# EAGLE design Resolver to digital concerter AD2S1210 (EAGLE 8.6.0)
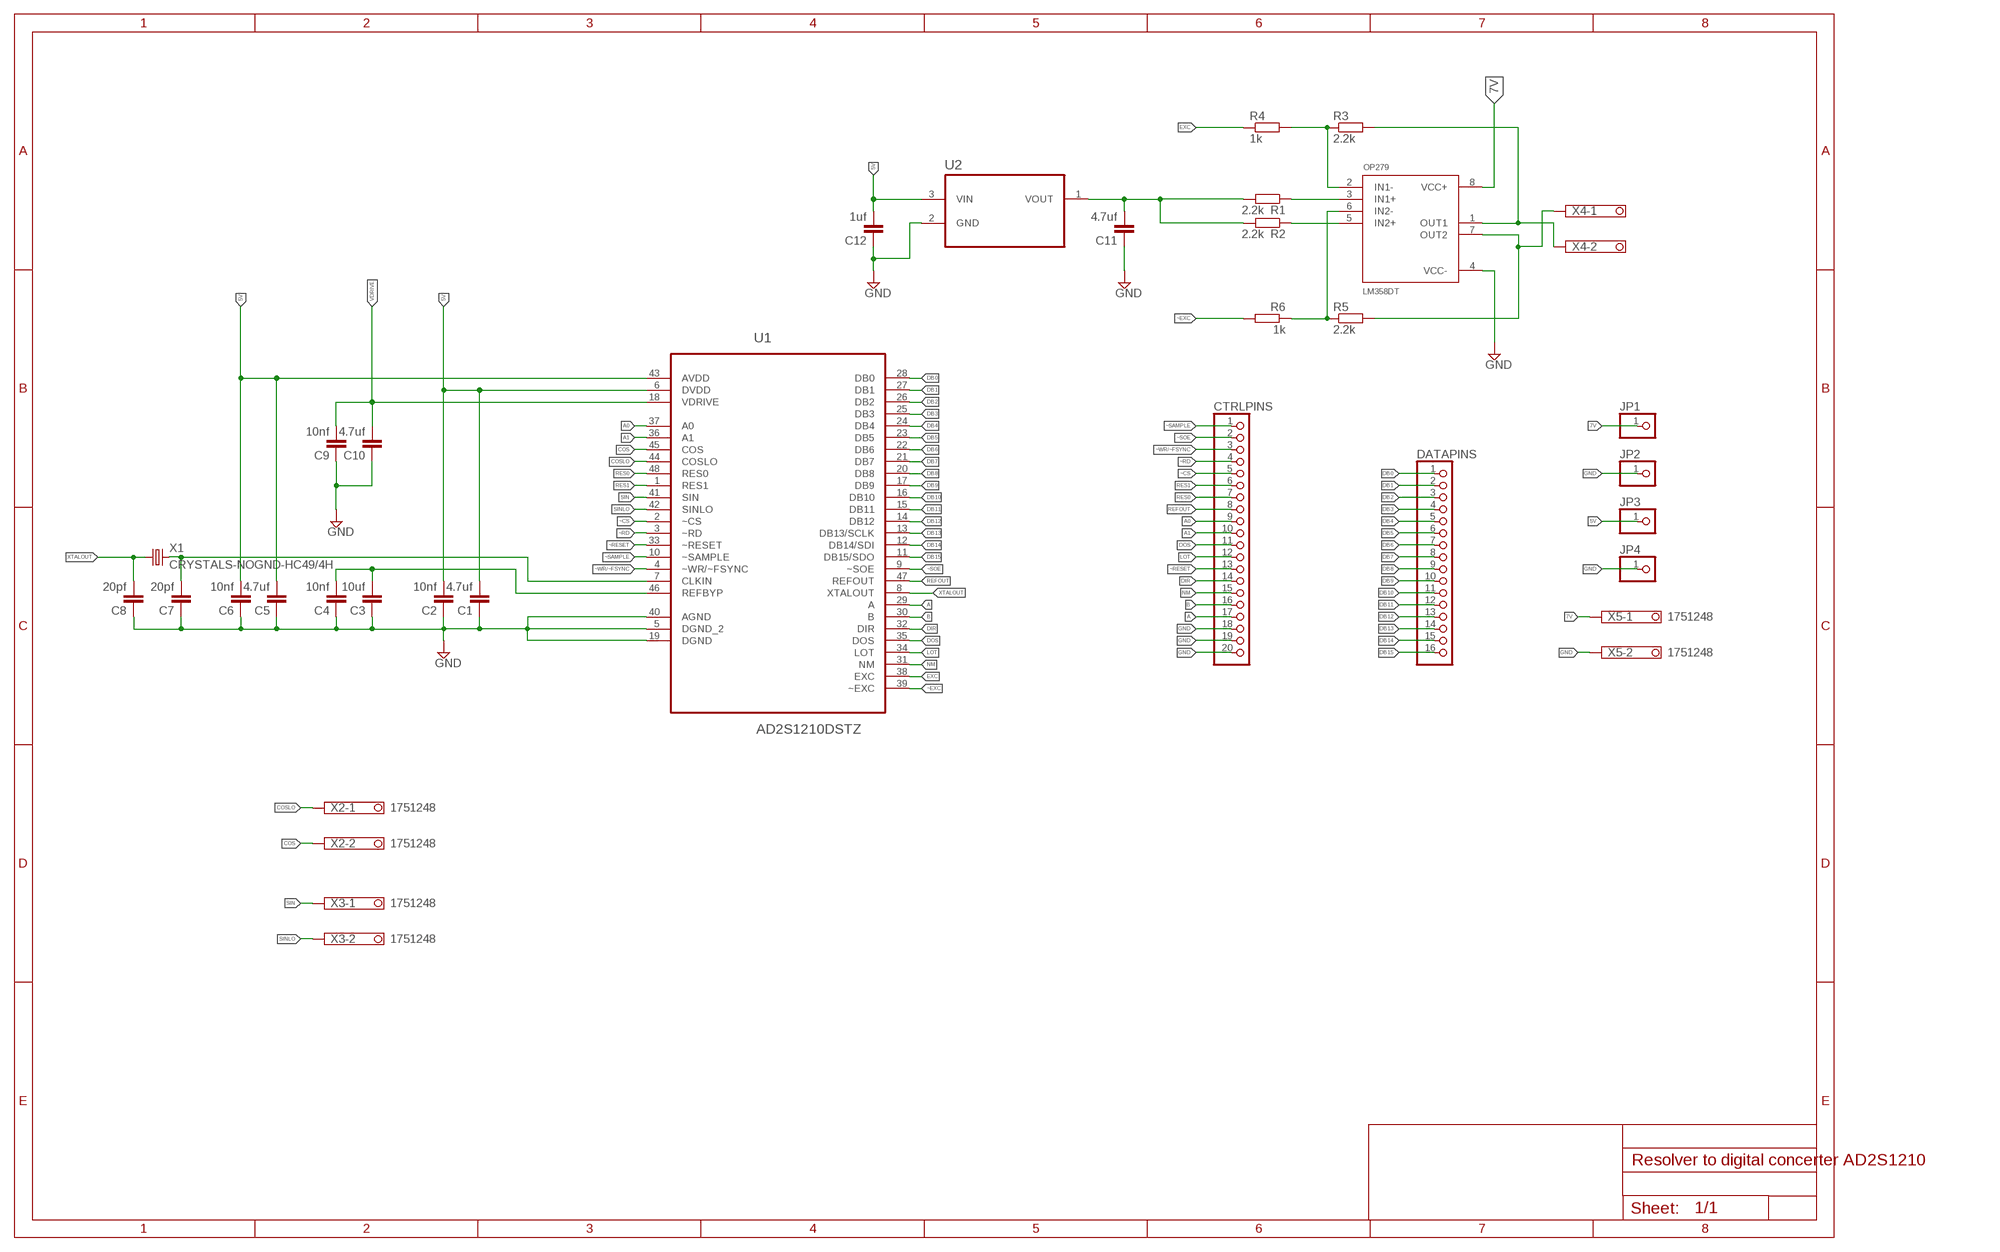
[diagram p0: schematic, sheet 1]

## Parts
C1  4.7uf  C-EUC0805  [C0805]
C2  10nf  C-EUC0805  [C0805]
C3  10uf  C-EUC0805  [C0805]
C4  10nf  C-EUC0805  [C0805]
C5  4.7uf  C-EUC0805  [C0805]
C6  10nf  C-EUC0805  [C0805]
C7  20pf  C-EUC0805  [C0805]
C8  20pf  C-EUC0805  [C0805]
C9  10nf  C-EUC0805  [C0805]
C10  4.7uf  C-EUC0805  [C0805]
C11  4.7uf  C-EUC0805  [C0805]
C12  1uf  C-EUC0805  [C0805]
CTRLPINS  PINHD-1X20  [1X20]
DATAPINS  PINHD-1X16  [1X16]
JP1  PINHD-1X1  [1X01]
JP2  PINHD-1X1  [1X01]
JP3  PINHD-1X1  [1X01]
JP4  PINHD-1X1  [1X01]
OP279  LM358DT  [SOIC127P600X175-8N]
R1  2.2k  R-EU_R0805  [R0805]
R2  2.2k  R-EU_R0805  [R0805]
R3  2.2k  R-EU_R0805  [R0805]
R4  1k  R-EU_R0805  [R0805]
R5  2.2k  R-EU_R0805  [R0805]
R6  1k  R-EU_R0805  [R0805]
U1  AD2S1210DSTZ  [QFP50P900X900X160-48N]
U2  AD1582BRTZ-REEL7  [SOT95P237X112-3N]
X1  CRYSTALS-NOGND-HC49/4H  [HC49]
X2  1751248  [1751248]
X3  1751248  [1751248]
X4  1751248  [1751248]
X5  1751248  [1751248]

## Nets
5V: C1.2 C2.2 C5.2 C6.2 C12.2 JP3.1 U1.6(DVDD) U1.43(AVDD) U2.3(VIN)
7V: JP1.1 OP279.8(VCC+) X5.1
A: CTRLPINS.17 U1.29(A)
A0: CTRLPINS.9 U1.37(A0)
A1: CTRLPINS.10 U1.36(A1)
B: CTRLPINS.16 U1.30(B)
COS: U1.45(COS) X2.2
COSLO: U1.44(COSLO) X2.1
DB0: DATAPINS.1 U1.28(DB0)
DB1: DATAPINS.2 U1.27(DB1)
DB2: DATAPINS.3 U1.26(DB2)
DB3: DATAPINS.4 U1.25(DB3)
DB4: DATAPINS.5 U1.24(DB4)
DB5: DATAPINS.6 U1.23(DB5)
DB6: DATAPINS.7 U1.22(DB6)
DB7: DATAPINS.8 U1.21(DB7)
DB8: DATAPINS.9 U1.20(DB8)
DB9: DATAPINS.10 U1.17(DB9)
DB10: DATAPINS.11 U1.16(DB10)
DB11: DATAPINS.12 U1.15(DB11)
DB12: DATAPINS.13 U1.14(DB12)
DB13: DATAPINS.14 U1.13(DB13/SCLK)
DB14: DATAPINS.15 U1.12(DB14/SDI)
DB15: DATAPINS.16 U1.11(DB15/SDO)
DIR: CTRLPINS.14 U1.32(DIR)
DOS: CTRLPINS.11 U1.35(DOS)
EXC: R4.1 U1.38(EXC)
GND: C1.1 C2.1 C3.1 C4.1 C5.1 C6.1 C7.1 C8.1 C9.1 C10.1 C11.1 C12.1 CTRLPINS.18 CTRLPINS.19 CTRLPINS.20 JP2.1 JP4.1 OP279.4(VCC-) U1.5(DGND_2) U1.19(DGND) U1.40(AGND) U2.2(GND) X5.2
LOT: CTRLPINS.12 U1.34(LOT)
N$1: OP279.3(IN1+) R1.1
N$2: OP279.5(IN2+) R2.1
N$3: C11.2 R1.2 R2.2 U2.1(VOUT)
N$4: OP279.1(OUT1) R3.2 X4.2
N$5: OP279.2(IN1-) R3.1 R4.2
N$7: OP279.7(OUT2) R5.2 X4.1
N$8: OP279.6(IN2-) R5.1 R6.1
N$11: C3.2 C4.2 U1.46(REFBYP)
N$12: C7.2 U1.7(CLKIN) X1.2
NM: CTRLPINS.15 U1.31(NM)
REFOUT: CTRLPINS.8 U1.47(REFOUT)
RES0: CTRLPINS.7 U1.48(RES0)
RES1: CTRLPINS.6 U1.1(RES1)
SIN: U1.41(SIN) X3.1
SINLO: U1.42(SINLO) X3.2
VDRIVE: C9.2 C10.2 U1.18(VDRIVE)
XTALOUT: C8.2 U1.8(XTALOUT) X1.1
~CS: CTRLPINS.5 U1.2(~CS)
~EXC: R6.2 U1.39(~EXC)
~RD: CTRLPINS.4 U1.3(~RD)
~RESET: CTRLPINS.13 U1.33(~RESET)
~SAMPLE: CTRLPINS.1 U1.10(~SAMPLE)
~SOE: CTRLPINS.2 U1.9(~SOE)
~WR/~FSYNC: CTRLPINS.3 U1.4(~WR/~FSYNC)

## Library data of the parts
C1-C12 = rcl:C-EU: CAPACITOR, European symbol; SPICEPREFIX: C
CTRLPINS = pinhead:PINHD-1X20: PIN HEADER
DATAPINS = pinhead:PINHD-1X16: PIN HEADER
JP1-JP4 = pinhead:PINHD-1X1: PIN HEADER
OP279 = LM358DT:LM358DT: LM358 Series 30 V 1.1 MHz Low Power Dual Operational Amplifier - SOIC-8; AVAILABILITY: Good; DESCRIPTION: LM358 Series 30 V 1.1 MHz Low Power Dual Operational Amplifier - SOIC-8; MF: STMicroelectronics; MP: LM358DT; PACKAGE: SOIC-8 STMicroelectronics; PRICE: 0.14 USD
R1-R6 = rcl:R-EU_: RESISTOR, European symbol; SPICEPREFIX: R
U1 = AD2S1210DSTZ:AD2S1210DSTZ: 10-Bit to 16-Bit R/D Converter; AVAILABILITY: Good; DESCRIPTION: Resolver to Digital 16-Bit Parallel/Serial (4-Wire, SPI) ±5arcmin 48-Pin LQFP; MF: Analog Devices; MP: AD2S1210DSTZ; PACKAGE: LQFP-48 Analog Devices; PRICE: 22.93 USD
U2 = AD1582BRTZ-REEL7:AD1582BRTZ-REEL7: 2.5 V to 5.0 V Micropower, Precision Series Mode Voltage References; AVAILABILITY: Good; DESCRIPTION: Ic, Ad1582brtz-Reel7, 2.5v Micr Opower Ref <Nv; MF: Analog Devices; MP: AD1582BRTZ-REEL7; PACKAGE: SOT-23 Analog Devices; PRICE: 1.70 USD
X1 = IQD-Frequency-Products:CRYSTALS-NOGND: CRYSTALS CAN NOT GROUNDED
X2-X5 = con-phoenix-350:1751248: MKDS 1/ 2-3,5 Printklemme Nennstrom: 10 A Bemessungsspannung: 160 V Raster: 3,5 mm Polzahl: 2 Montageart: Löten Anschlussart: Schraubanschluss Anschlussrichtung vom Leiter zur Platine: 0° Source: http://eshop.phoenixcontact.com .. 1751248.pdf; OC_FARNELL: unknown; OC_NEWARK: unknown

## Board
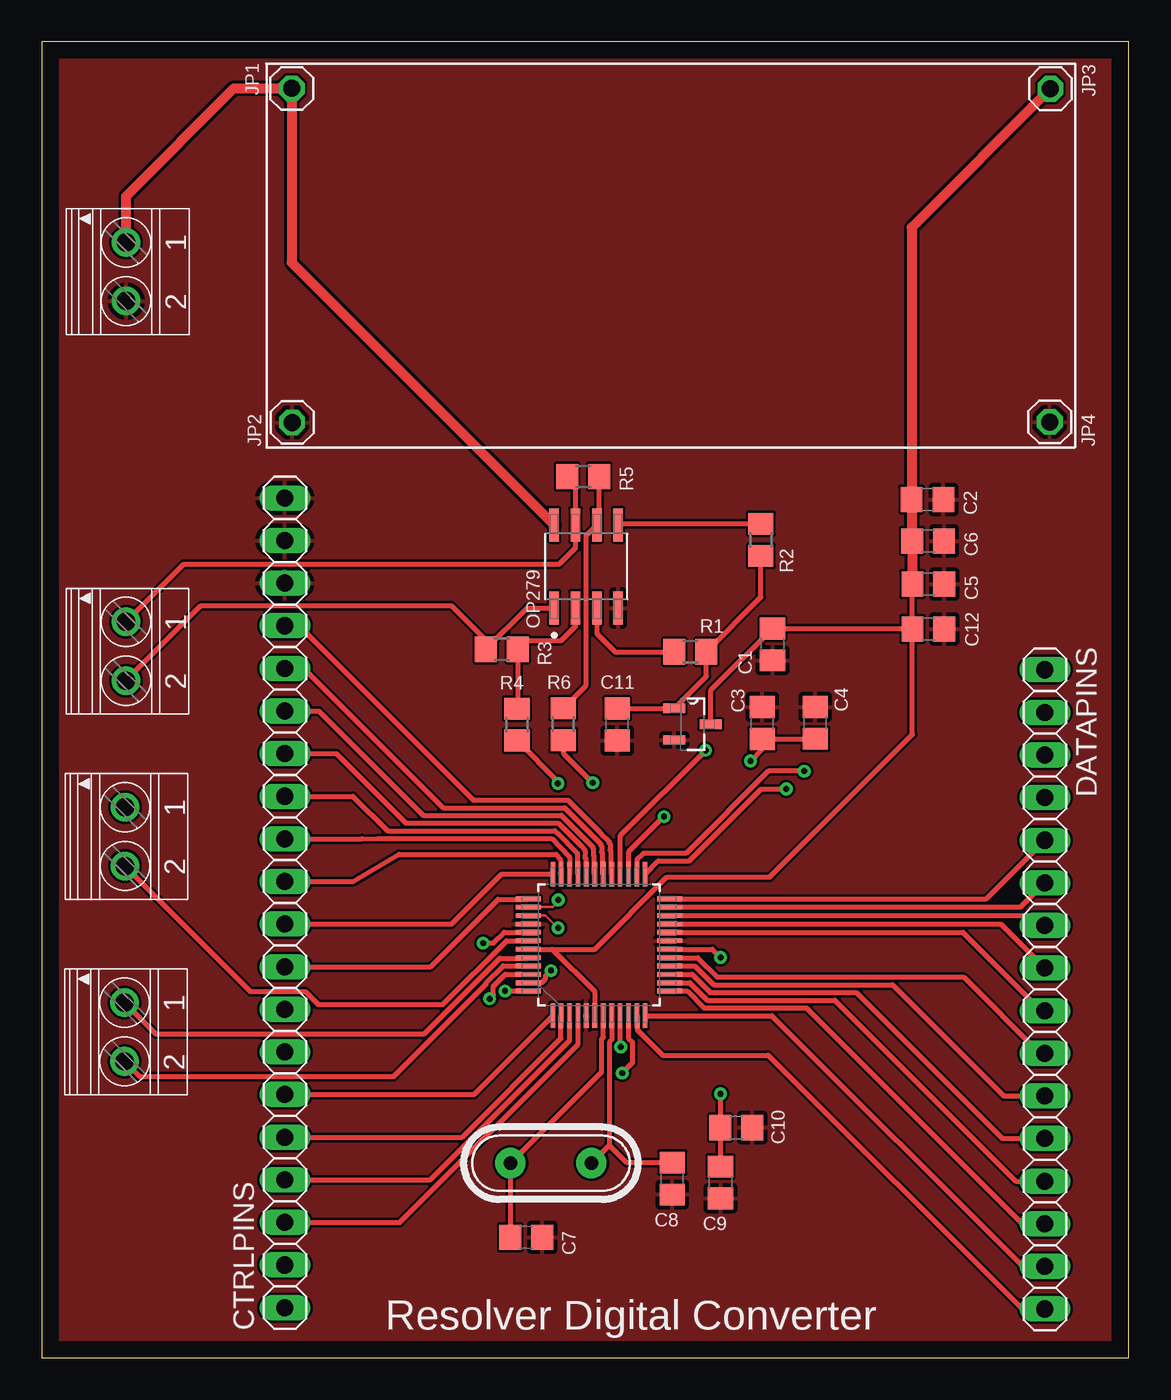
[diagram p1: board, top side]
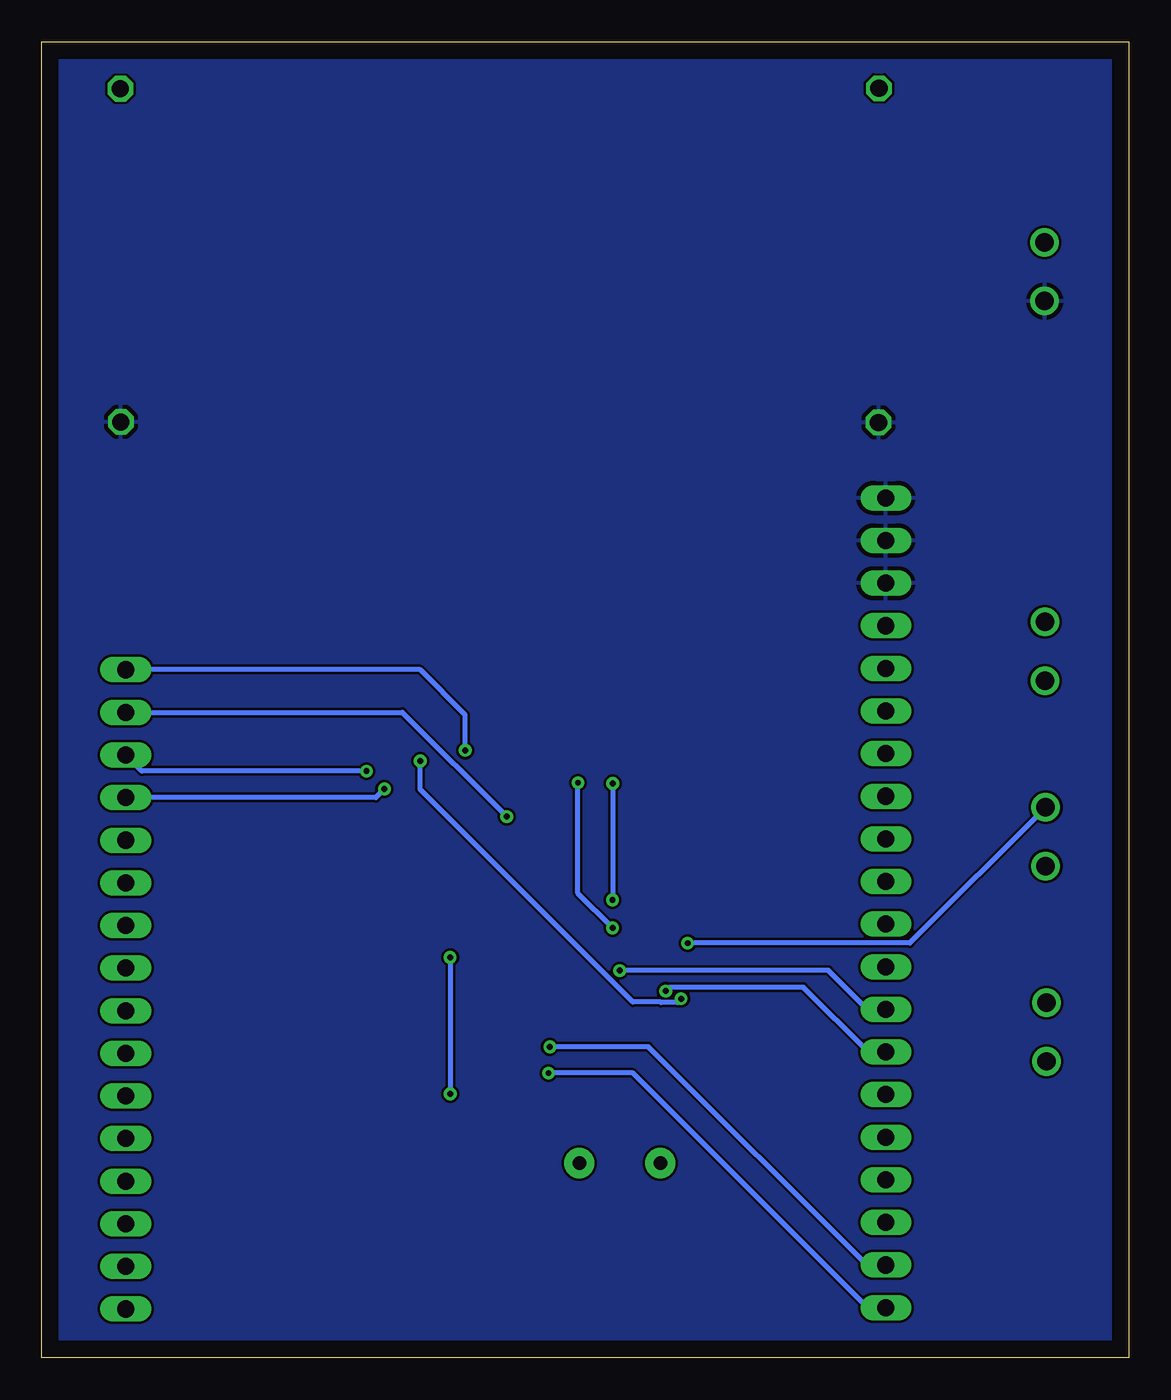
[diagram p2: board, bottom side, seen from below]

Size 64.75 x 78.41 mm. Coordinates in mm from the lower left corner, seen from the top.
Outline: 0,0 64.75,0 64.75,78.41 0,78.41 0,0
Copper layers (1*16): Top 0.035mm / dielectric 1.5mm / Bottom 0.035mm
Design rules "default": minimum track width 6mil, minimum drill 0.35mm, track to track 6mil, track to pad 6mil, pad to pad 6mil, via to via 6mil, smd to smd 6mil, copper to edge 40mil, drill to drill 6mil, minimum pad ring 10mil, minimum via ring 8mil, stop-mask expansion 4mil, vias tented up to drill 0mil, thermal gap 10mil

### Footprints (pad centres in the part's own frame; a part is rotated, then mirrored left to right if it is on the bottom)
C0805 = smd 1.3 x 1.5: 1 -0.95,0; 2 0.95,0
1X20 = drill 1.016 long: 1 -24.13,0; 2 -21.59,0; 3 -19.05,0; 4 -16.51,0; 5 -13.97,0; 6 -11.43,0; 7 -8.89,0; 8 -6.35,0; 9 -3.81,0; 10 -1.27,0; 11 1.27,0; 12 3.81,0; 13 6.35,0; 14 8.89,0; 15 11.43,0; 16 13.97,0; 17 16.51,0; 18 19.05,0; 19 21.59,0; 20 24.13,0
1X16 = drill 1.016 long: 1 -19.05,0; 2 -16.51,0; 3 -13.97,0; 4 -11.43,0; 5 -8.89,0; 6 -6.35,0; 7 -3.81,0; 8 -1.27,0; 9 1.27,0; 10 3.81,0; 11 6.35,0; 12 8.89,0; 13 11.43,0; 14 13.97,0; 15 16.51,0; 16 19.05,0
1X01 = drill 1.016 octagon: 1 0,0
SOIC127P600X175-8N = smd 1.97 x 0.57: 1 -2.475,1.905; 2 -2.475,0.635; 3 -2.475,-0.635; 4 -2.475,-1.905; 5 2.475,-1.905; 6 2.475,-0.635; 7 2.475,0.635; 8 2.475,1.905
R0805 = smd 1.3 x 1.5: 1 -0.95,0; 2 0.95,0
QFP50P900X900X160-48N = smd 1.473 x 0.279: 1 -4.216,2.743; 2 -4.216,2.261; 3 -4.216,1.753; 4 -4.216,1.245; 5 -4.216,0.762; 6 -4.216,0.254; 7 -4.216,-0.254; 8 -4.216,-0.762; 9 -4.216,-1.245; 10 -4.216,-1.753; 11 -4.216,-2.261; 12 -4.216,-2.743; 25 4.216,-2.743; 26 4.216,-2.261; 27 4.216,-1.753; 28 4.216,-1.245; 29 4.216,-0.762; 30 4.216,-0.254; 31 4.216,0.254; 32 4.216,0.762; 33 4.216,1.245; 34 4.216,1.753; 35 4.216,2.261; 36 4.216,2.743 | smd 0.279 x 1.473: 13 -2.743,-4.216; 14 -2.261,-4.216; 15 -1.753,-4.216; 16 -1.245,-4.216; 17 -0.762,-4.216; 18 -0.254,-4.216; 19 0.254,-4.216; 20 0.762,-4.216; 21 1.245,-4.216; 22 1.753,-4.216; 23 2.261,-4.216; 24 2.743,-4.216; 37 2.743,4.216; 38 2.261,4.216; 39 1.753,4.216; 40 1.245,4.216; 41 0.762,4.216; 42 0.254,4.216; 43 -0.254,4.216; 44 -0.762,4.216; 45 -1.245,4.216; 46 -1.753,4.216; 47 -2.261,4.216; 48 -2.743,4.216
SOT95P237X112-3N = smd 1.321 x 0.559: 1 -1.092,0.94; 2 -1.092,-0.94; 3 1.092,0
HC49 = drill 0.813 pad 1.8: 1 -2.413,0; 2 2.413,0
1751248 = drill 1.1 pad 1.7: 1 -1.75,-0.1; 2 1.75,-0.1

### Placement (x,y rotation side)
C1  43.53,42.5 90 top
C2  52.76,51.14 180 top
C3  42.92,37.82 270 top
C4  46.07,37.83 270 top
C5  52.81,46.1 180 top
C6  52.8,48.67 180 top
C7  28.85,7.17 180 top
C8  37.55,10.67 90 top
C9  40.43,10.43 90 top
C10  41.36,13.71 180 top
C11  34.27,37.74 90 top
C12  52.81,43.42 180 top
CTRLPINS  14.47,27.1 90 top
DATAPINS  59.76,21.94 270 top
JP1  14.88,75.64 0 top
JP2  14.91,55.73 0 top
JP3  60.08,75.62 0 top
JP4  60.04,55.76 0 top
OP279  32.42,47.15 90 top
R1  38.63,42.06 0 top
R2  42.83,48.74 270 top
R3  27.39,42.22 180 top
R4  28.31,37.72 90 top
R5  32.25,52.51 180 top
R6  31.06,37.74 270 top
U1  33.19,24.59 90 top
U2  38.75,37.75 0 top
X1  30.32,11.59 180 top
X2  5.01,19.4 270 top
X3  5.05,31.05 270 top
X4  5.1,42.1 270 top
X5  5.11,64.72 270 top

### Tracks (layer width: path | path; a pad name or v marks a point on that pad's centre or on a via)
5V
  Top 0.152: 51.82,51.1 C2.2 | 51.82,48.82 C6.2
  Top 0.305: U2.3 39.85,39.77 C1.2 51.82,43.45 C12.2 | C12.2 C5.2 51.85,46.11 | U1.43 30.4,24.34 | 30.4,24.34 32.93,21.81 32.93,20.38 U1.6 | 30.4,24.34 32.94,24.34 37.23,28.63 43.37,28.63 51.86,37.13 C12.2
  Top 0.61: JP3.1 51.82,67.35 51.82,51.1 | C2.2 51.81,48.71 C6.2 51.85,46.11 C5.2
7V
  Top 0.61: X5.1 5.01,69.21 11.44,75.64 JP1.1 14.88,65.27 OP279.8
A
  Top 0.305: CTRLPINS.17 15.29,43.61 25.68,33.22 31.33,33.22 33.2,31.35 33.21,31.35 33.34,31.22 33.73,30.83 33.73,30.82 33.73,30.81 33.73,30.8 33.77,30.76 33.77,30.75 33.8,30.73 33.8,30.67 33.85,30.62 33.85,30.24 33.9,30.19 33.9,28.86 U1.29
A0
  Top 0.305: CTRLPINS.9 23.15,23.29 27.17,27.32 28.95,27.32 U1.37
A1
  Top 0.305: CTRLPINS.10 24.4,25.83 27.39,28.82 30.43,28.82 U1.36
B
  Top 0.305: CTRLPINS.16 15.6,41.07 23.9,32.77 31.14,32.77 33.01,30.9 33.26,30.63 33.27,30.63 33.27,30.62 33.28,30.61 33.28,30.6 33.31,30.56 33.31,30.5 33.34,30.48 33.34,30.11 33.39,30.06 33.39,28.86 U1.30
COS
  Top 0.305: X2.2 5.82,16.75 20.97,16.75 26.44,22.23 26.44,22.32 27.47,23.35 U1.45
COSLO
  Top 0.305: X2.1 6.77,19.29 22.77,19.29 27.29,23.8 28.95,23.8 U1.44
DB0  (via drill 0.35)
  Top 0.305: v39.54,36.19 34.43,31.08 U1.28
  Bottom 0.305: v39.54,36.19 39.54,38.31 42.22,40.99 DATAPINS.1
DB1  (via drill 0.35)
  Top 0.305: v37.06,32.24 34.94,30.12 U1.27
  Bottom 0.305: DATAPINS.2 43.27,38.45 v37.06,32.24 | v37.06,32.24
DB2  (via drill 0.35)
  Top 0.152: 45.41,34.96 v45.41,34.95
  Top 0.305: v45.41,34.95 43.27,34.95 38.38,30.06 35.85,30.06 35.45,29.66 U1.26
  Bottom 0.305: v45.41,34.95 58.79,34.95 DATAPINS.3
DB3  (via drill 0.35)
  Top 0.305: U1.25 36.73,29.6 38.57,29.6 42.85,33.88 v44.35,33.88
  Bottom 0.305: v44.35,33.88 44.86,33.37 DATAPINS.4
DB4
  Top 0.305: U1.24 56.26,27.33 DATAPINS.5
DB5
  Top 0.305: U1.23 58.31,26.85 DATAPINS.6
DB6
  Top 0.305: U1.22 59.16,26.34 DATAPINS.7
DB7
  Top 0.305: U1.21 57.13,25.83 DATAPINS.8
DB8
  Top 0.305: U1.20 54.87,25.35 59.55,20.67 DATAPINS.9
DB9
  Top 0.305: U1.17 39.07,23.83 40.23,22.68 54.92,22.68 59.46,18.13 DATAPINS.10
DB10
  Top 0.152: 36.73,23.37 37.34,23.37 U1.16
  Top 0.305: U1.16 37.47,23.34 38.89,23.33 40.04,22.22 50.68,22.22 57.3,15.59 DATAPINS.11
DB11
  Top 0.305: U1.15 38.73,22.84 39.81,21.76 39.85,21.76 40.04,21.76 48.51,21.76 57.22,13.05 DATAPINS.12
DB12
  Top 0.305: U1.14 38.59,22.33 39.63,21.3 47.24,21.3 58.02,10.51 DATAPINS.13
DB13
  Top 0.305: U1.13 38.43,21.85 39.44,20.84 45.54,20.84 58.41,7.97 DATAPINS.14
DB14
  Top 0.305: U1.12 43.49,20.37 58.43,5.43 DATAPINS.15
DB15
  Top 0.305: U1.11 35.47,20.35 35.47,19.52 36.98,18.02 43.27,18.02 58.4,2.89 DATAPINS.16
DIR
  Top 0.305: CTRLPINS.14 17.54,35.99 21.68,31.85 30.75,31.85 32.09,30.51 32.35,30.24 32.35,30.18 32.36,30.17 32.35,29.8 32.4,29.75 32.4,28.83 U1.32
DOS
  Top 0.305: CTRLPINS.11 18.54,28.37 21.27,29.99 30.62,29.99 30.9,29.66 30.9,28.83 U1.35
EXC  (via drill 0.35)
  Top 0.152: U1.38 30.43,26.85 30.76,27.18 v30.76,27.28
  Top 0.305: R4.1 30.74,34.34 v30.74,34.22
  Bottom 0.152: 30.78,34.18 v30.74,34.22
  Bottom 0.305: v30.74,34.22 30.74,27.3 v30.76,27.28
GND
  pour Top: -1.27,80.01 66.04,80.01 66.04,-1.27 -1.27,-1.27
  pour Bottom: -1.27,80.01 66.04,80.01 66.04,-1.27 -1.27,-1.27
LOT
  Top 0.305: CTRLPINS.12 19.06,30.91 20.03,30.93 30.36,30.93 31.43,29.81 U1.34
N$1
  Top 0.305: OP279.3 33.06,43.14 34.14,42.06 R1.1
N$2
  Top 0.305: R2.1 34.39,49.69 OP279.5
N$3
  Top 0.305: C11.2 U2.1 39.58,40.6 R1.2 42.83,45.31 R2.2
N$4
  Top 0.305: X4.2 9.46,44.81 24.39,44.81 26.44,42.75 R3.2 28.9,44.68 OP279.1
N$5
  Top 0.305: OP279.2 31.79,43.59 30.93,42.73 28.86,42.73 R3.1 28.34,38.71 R4.2
N$7
  Top 0.305: X4.1 8.45,47.29 30.82,47.29 31.79,48.26 OP279.7 31.79,52.02 R5.2
N$8
  Top 0.305: R6.1 32.43,40.06 32.43,49 OP279.6 33.2,49.77 R5.1
N$11  (via drill 0.35)
  Top 0.305: v26.67,21.39 26.9,21.62 26.9,22.13 27.61,22.84 U1.46 | v42.22,35.56 42.92,36.26 C3.2 C4.2
  Bottom 0.305: v26.67,21.39 26.9,21.16 27.87,21.16 27.9,21.19 29.54,21.19 42.22,33.87 v42.22,35.56
N$12
  Top 0.152: 27.89,7.21 C7.2
  Top 0.305: C7.2 X1.2 33.35,17.03 33.35,18.99 33.44,19.08 U1.7
NM
  Top 0.305: CTRLPINS.15 16.5,38.53 22.73,32.31 30.94,32.31 32.29,30.96 32.42,30.83 32.81,30.44 32.81,30.43 32.81,30.42 32.82,30.41 32.82,30.35 32.86,30.31 32.86,29.94 32.88,29.92 32.88,28.86 U1.31
REFOUT  (via drill 0.35)
  Top 0.305: v30.33,23.06 30.01,22.75 30.01,22.57 29.77,22.33 U1.47
  Bottom 0.152: 14.48,20.78 CTRLPINS.8
  Bottom 0.305: CTRLPINS.8 15.58,20.75 17.9,23.08 30.31,23.08 v30.33,23.06
RES0  (via drill 0.35)
  Top 0.305: v27.58,21.84 U1.48
  Bottom 0.152: 14.48,18.34 CTRLPINS.7
  Bottom 0.305: CTRLPINS.7 15.53,18.21 19.38,22.07 27.36,22.07 v27.58,21.84
RES1
  Top 0.305: CTRLPINS.6 25.75,15.67 U1.1
SIN  (via drill 0.35)
  Top 0.152: 26.3,24.7 v26.28,24.7
  Top 0.305: v26.28,24.7 26.89,24.7 27.54,25.35 U1.41
  Bottom 0.305: X3.1 13.04,24.7 v26.28,24.7
SINLO
  Top 0.305: X3.2 12.42,21.82 15.68,21.82 16.45,21.05 23.88,21.05 27.68,24.85 U1.42
VDRIVE  (via drill 0.35)
  Top 0.305: v40.43,15.72 40.43,13.72 C10.2 40.41,11.4 C9.2 | U1.18 39.95,24.34 v40.43,23.85
  Bottom 0.152: v40.43,15.72
  Bottom 0.305: v40.43,23.85 v40.43,15.72
XTALOUT
  Top 0.305: U1.8 33.95,18.95 33.81,18.8 33.81,12.66 | 33.81,12.66 X1.1 | C8.2 34.85,11.62 33.81,12.66
~CS
  Top 0.305: CTRLPINS.5 25.03,13.13 30.91,19.01 30.91,20.36 U1.2
~EXC  (via drill 0.35)
  Top 0.152: U1.39 29.99,26.34 30.75,25.58 v30.75,25.61
  Top 0.305: R6.2 31.06,36.01 v32.81,34.26
  Bottom 0.305: v30.75,25.61 32.81,27.67 v32.81,34.26
~RD
  Top 0.305: CTRLPINS.4 23.14,10.59 31.43,18.89 U1.3
~RESET
  Top 0.305: CTRLPINS.13 18.53,33.45 20.59,31.4 30.55,31.4 30.56,31.39 30.69,31.25 31.89,30.05 31.89,30 31.9,29.99 31.89,29.81 31.89,28.86 U1.33
~SAMPLE  (via drill 0.35)
  Top 0.305: U1.10 34.94,19.03 35.17,18.8 35.17,17.55 v34.58,16.95
  Bottom 0.152: 14.48,3.1 CTRLPINS.1
  Bottom 0.305: CTRLPINS.1 15.56,2.97 29.55,16.97 34.56,16.97 v34.58,16.95
~SOE  (via drill 0.35)
  Top 0.305: U1.9 34.43,18.57 v34.49,18.52
  Bottom 0.152: 14.48,5.54 CTRLPINS.2
  Bottom 0.305: CTRLPINS.2 15.62,5.51 28.62,18.52 v34.49,18.52
~WR/~FSYNC
  Top 0.305: CTRLPINS.3 21.32,8.05 31.94,18.68 U1.4

### Text on the board
tPlace: Resolver Digital Converter